# EAGLE design xduino360 (EAGLE 6.4)
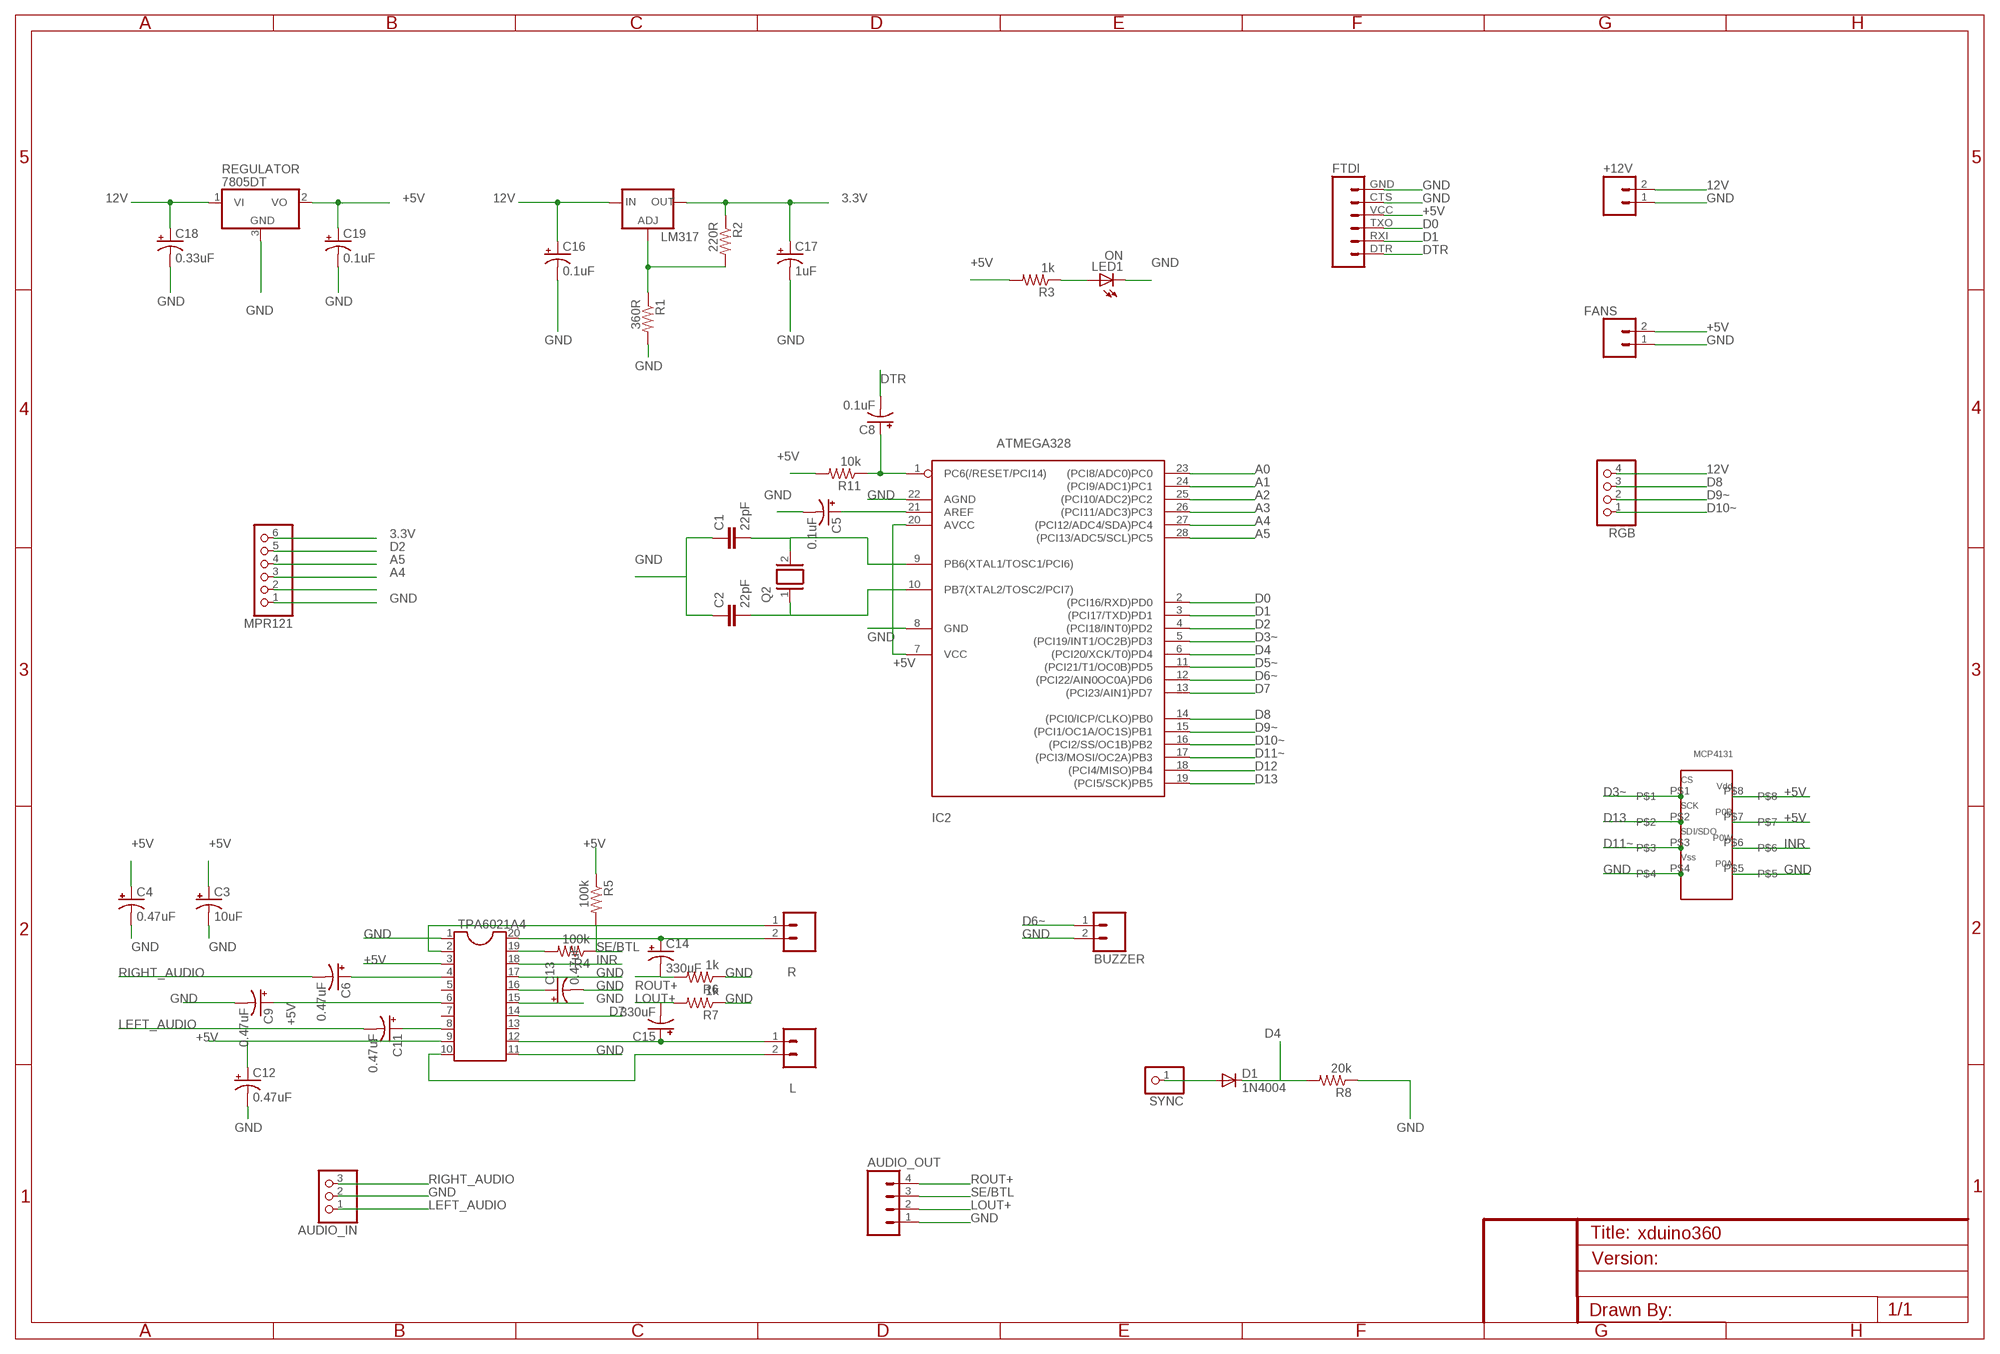
[diagram p0: schematic, sheet 1]

## Parts
+12V  M02PTH  [1X02]
AUDIO_IN  PINHD-1X3  [1X03]
AUDIO_OUT  M04PTH  [1X04]
BUZZER  M02PTH  [1X02]
C1  22pF  C5/2.5  [C5B2.5]
C2  22pF  C5/2.5  [C5B2.5]
C3  10uF  CPOL-USTT2D5  [TT2D5]
C4  0.47uF  CPOL-USTT2D5  [TT2D5]
C5  0.1uF  CPOL-USTT2D5  [TT2D5]
C6  0.47uF  CPOL-USTT2D5  [TT2D5]
C8  0.1uF  CPOL-USTT2D5  [TT2D5]
C9  0.47uF  CPOL-USTT2D5  [TT2D5]
C11  0.47uF  CPOL-USTT2D5  [TT2D5]
C12  0.47uF  CPOL-USTT2D5  [TT2D5]
C13  0.47uF  CPOL-USTT2D5  [TT2D5]
C14  330uF  CPOL-USTT2D5  [TT2D5]
C15  330uF  CPOL-USTT2D5  [TT2D5]
C16  0.1uF  CPOL-USTT2D5  [TT2D5]
C17  1uF  CPOL-USTT2D5  [TT2D5]
C18  0.33uF  CPOL-USTT2D5  [TT2D5]
C19  0.1uF  CPOL-USTT2D5  [TT2D5]
D1  1N4004  [DO41-10]
FANS  M02PTH  [1X02]
FTDI  FTDI_BASICPTH  [FTDI_BASIC]
IC2  ATMEGA328  ATMEGA168V-10P  [DIL28-3]
L  M02PTH  [1X02]
LED1  ON  LED3MM  [LED3MM]
LM317  V_REG_317DPACK  [V-REG_DPACK]
MCP4131  MCP4131  [MCP4131]
MPR121  PINHD-1X6  [1X06]
Q2  XTAL/S  [QS]
R  M02PTH  [1X02]
R1  360R  R-US_0204/2V  [0204V]
R2  220R  R-US_0204/2V  [0204V]
R3  1k  R-US_0204/2V  [0204V]
R4  100k  R-US_0204/2V  [0204V]
R5  100k  R-US_0204/2V  [0204V]
R6  1k  R-US_0204/2V  [0204V]
R7  1k  R-US_0204/2V  [0204V]
R8  20k  R-US_0204/2V  [0204V]
R11  10k  R-US_0204/2V  [0204V]
REGULATOR  7805DT  [TO252]
RGB  PINHD-1X4  [1X04]
SYNC  PINHD-1X1  [1X01]
TPA6021A4  DIL20  [DIL20]

## Nets
3.3V: C17.+ LM317.4(OUT) MPR121.6 R2.1
12V: +12V.2 C16.+ C18.+ LM317.3(IN) REGULATOR.1(VI) RGB.4
+5V: C3.+ C4.+ C9.+ C12.+ C19.+ FANS.2 FTDI.VCC IC2.7(VCC) IC2.20(AVCC) MCP4131.P$7 MCP4131.P$8 R3.2 R5.1 R11.2 REGULATOR.2(VO) TPA6021A4.3 TPA6021A4.6 TPA6021A4.9
A0: IC2.23((PCI8/ADC0)PC0)
A1: IC2.24((PCI9/ADC1)PC1)
A2: IC2.25((PCI10/ADC2)PC2)
A3: IC2.26((PCI11/ADC3)PC3)
A4: IC2.27((PCI12/ADC4/SDA)PC4) MPR121.3
A5: IC2.28((PCI13/ADC5/SCL)PC5) MPR121.4
D0: FTDI.TXO IC2.2((PCI16/RXD)PD0)
D1: FTDI.RXI IC2.3((PCI17/TXD)PD1)
D2: IC2.4((PCI18/INT0)PD2) MPR121.5
D3~: IC2.5((PCI19/INT1/OC2B)PD3) MCP4131.P$1
D4: D1.C IC2.6((PCI20/XCK/T0)PD4) R8.2
D5~: IC2.11((PCI21/T1/OC0B)PD5)
D6~: BUZZER.1 IC2.12((PCI22/AIN0OC0A)PD6)
D7: IC2.13((PCI23/AIN1)PD7) TPA6021A4.14
D8: IC2.14((PCI0/ICP/CLKO)PB0) RGB.3
D9~: IC2.15((PCI1/OC1A/OC1S)PB1) RGB.2
D10~: IC2.16((PCI2/SS/OC1B)PB2) RGB.1
D11~: IC2.17((PCI3/MOSI/OC2A)PB3) MCP4131.P$3
D12: IC2.18((PCI4/MISO)PB4)
D13: IC2.19((PCI5/SCK)PB5) MCP4131.P$2
DTR: C8.- FTDI.DTR
GND: +12V.1 AUDIO_IN.2 AUDIO_OUT.1 BUZZER.2 C1.1 C2.1 C3.- C4.- C5.- C9.- C12.- C13.- C16.- C17.- C18.- C19.- FANS.1 FTDI.CTS FTDI.GND IC2.8(GND) IC2.22(AGND) LED1.K(C) MCP4131.P$4 MCP4131.P$5 MPR121.1 R1.2 R6.1 R7.1 R8.1 REGULATOR.3(GND) TPA6021A4.1 TPA6021A4.11 TPA6021A4.15 TPA6021A4.17
INR: MCP4131.P$6 TPA6021A4.18
LEFT_AUDIO: AUDIO_IN.1 C11.-
LOUT+: AUDIO_OUT.2 C15.- R7.2
N$1: LM317.1(ADJ) R1.1 R2.2
N$2: C8.+ IC2.1(PC6(/RESET/PCI14)) R11.1
N$3: C2.2 IC2.10(PB7(XTAL2/TOSC2/PCI7)) Q2.1
N$6: C6.+ TPA6021A4.4
N$8: C1.2 IC2.9(PB6(XTAL1/TOSC1/PCI6)) Q2.2
N$9: C5.+ IC2.21(AREF)
N$12: C11.+ TPA6021A4.8
N$14: R.1 TPA6021A4.2
N$15: C13.+ TPA6021A4.16
N$16: R4.2 TPA6021A4.19
N$18: C14.+ R.2 TPA6021A4.20
N$20: C15.+ L.1 TPA6021A4.12
N$21: L.2 TPA6021A4.10
N$24: D1.A SYNC.1
N$25: MPR121.2
N$33: LED1.A R3.1
RIGHT_AUDIO: AUDIO_IN.3 C6.-
ROUT+: AUDIO_OUT.4 C14.- R6.2
SE/BTL: AUDIO_OUT.3 R4.1 R5.2
Unconnected: TPA6021A4.5 TPA6021A4.7 TPA6021A4.13

## Library data of the parts
+12V BUZZER FANS L R = SparkFun-Connectors:M02: Header 2 Standard 2-pin 0.1" header. Use with straight break away headers (SKU : PRT-00116), right angle break away headers (PRT-00553), swiss pins (PRT-00743), machine pins (PRT-00117), and female headers (PRT-00115). Molex polarized connector foot print use with SKU : PRT-08233 with associated crimp pins and housings.
AUDIO_IN = adafruit:PINHD-1X3: PIN HEADER
AUDIO_OUT = SparkFun-Connectors:M04: Header 4 Standard 4-pin 0.1" header. Use with straight break away headers (SKU : PRT-00116), right angle break away headers (PRT-00553), swiss pins (PRT-00743), machine pins (PRT-00117), and female headers (PRT-00115). Molex polarized connector foot print use with SKU : PRT-08231 with associated crimp pins and housings. 1MM SMD Version SKU: PRT-10208
C1 C2 = capacitor-wima:C: CAPACITOR naming: grid - package width
C3-C6 C8 C9 C11-C19 = adafruit:CPOL-US: POLARIZED CAPACITOR, American symbol
D1 = adafruit:1N4004: DIODE General purpose 1N400x type rectifier (With bigger pads) http://www.ladyada.net/library/pcb/eaglelibrary.html
FTDI = SparkFun-Connectors:FTDI_BASIC: FTDI Basic header with labels
IC2 = adafruit:ATMEGA168*P: MICROCONTROLLER 16 kBytes FLASH 1 kBytes SRAM 512 Bytes EEPROM USART 8-channel 10 bit ADC
LED1 = adafruit:LED: LED OSRAM: - CHIPLED LG R971, LG N971, LY N971, LG Q971, LY Q971, LO R971, LY R971 LH N974, LH R974 LS Q976, LO Q976, LY Q976 LO Q996 - Hyper CHIPLED LW Q18S LB Q993, LB Q99A, LB R99A - SideLED LS A670, LO A670, LY A670, LG A670, LP A670 LB A673, LV A673, LT A673, LW A673 LH A674 LY A675 LS A676, LA A676, LO A676, LY A676, LW A676 LS A679, LY A679, LG A679 - Hyper Micro SIDELED® LS Y876, LA Y876, LO Y876, LY Y876 LT Y87S - SmartLED LW L88C, LW L88S LB L89C, LB L89S, LG L890 LS L89K, LO L89K, LY L89K LS L896, LA L896, LO L896, LY L896 - TOPLED LS T670, LO T670, LY T670, LG T670, LP T670 LSG T670, LSP T670, LSY T670, LOP T670, LYG T670 LG T671, LOG T671, LSG T671 LB T673, LV T673, LT T673, LW T673 LH T674 LS T676, LA T676, LO T676, LY T676, LB T676, LH T676, LSB T676, LW T676 LB T67C, LV T67C, LT T67C, LS T67K, LO T67K, LY T67K, LW E67C LS E67B, LA E67B, LO E67B, LY E67B, LB E67C, LV E67C, LT E67C LW T67C LS T679, LY T679, LG T679 LS T770, LO T770, LY T770, LG T770, LP T770 LB T773, LV T773, LT T773, LW T773 LH T774 LS E675, LA E675, LY E675, LS T675 LS T776, LA T776, LO T776, LY T776, LB T776 LHGB T686 LT T68C, LB T68C - Hyper Mini TOPLED® LB M676 - Mini TOPLED Santana® LG M470 LS M47K, LO M47K, LY M47K Source: http://www.osram.convergy.de/
LM317 = SparkFun-PowerIC:V_REG_317: Voltage Regulator Standard LM317 adjustable voltage regulator. AOI (Adjust Output Input). Google 'LM317 Calculator' for easy to use app to get the two resistor values needed. 240/720 for 5V output. 240/390 for 3.3V output. Spark Fun Electronics SKU : COM-00527
MCP4131 = mcp4131:MCP4131
MPR121 = adafruit:PINHD-1X6: PIN HEADER
Q2 = special:XTAL/S: CRYSTAL
R1-R8 R11 = adafruit:R-US_: RESISTOR, American symbol
REGULATOR = linear:78*: Positive VOLTAGE REGULATOR Source: http://cache.national.com/ds/LM/LM78L05.pdf http://www.fairchildsemi.com/ds/LM/LM7805.pdf
RGB = pinhead:PINHD-1X4: PIN HEADER
SYNC = adafruit:PINHD-1X1: Pin header 1x1 for 0.1" spacing With round pins
TPA6021A4 = ic-package:DIL20: Dual In Line / Socket

## Net classes
0 default: width 0.152 mm, drill 0.635 mm, clearance 0.254 mm

## Board
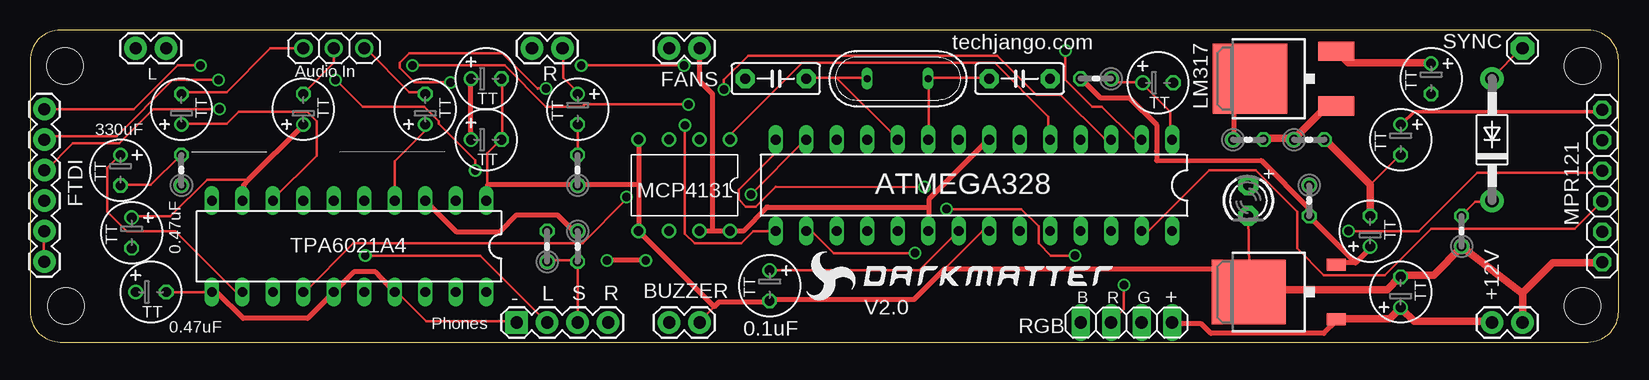
[diagram p1: board, top side]
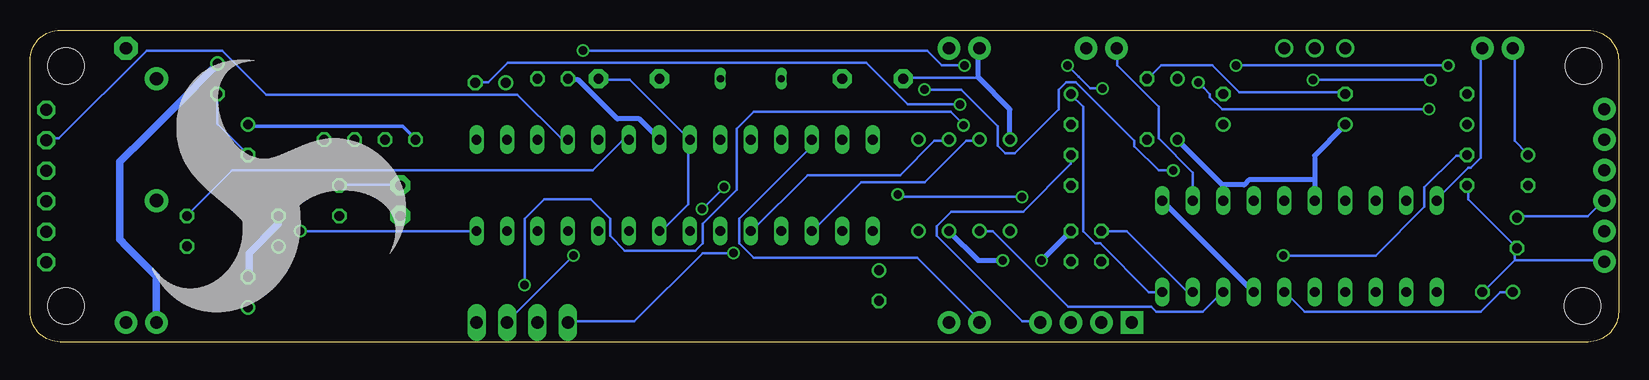
[diagram p2: board, bottom side, seen from below]

Size 132.38 x 26 mm. Coordinates in mm from the lower left corner, seen from the top.
Outline: 2.54,0 129.84,0 arc90 132.38,2.54 132.38,23.46 arc90 129.84,26 2.54,26 arc90 0,23.46 0,2.54 arc90 2.54,0
Copper layers (1*2*15*16): Top 0.035mm / dielectric 0.2mm / Route2 0.0175mm / dielectric 1.1mm / Route15 0.0175mm / dielectric 0.2mm / Bottom 0.035mm
Design rules "SeeedStudio_DRU_no_angle_20130527 *": minimum track width 8mil, minimum drill 12mil, track to track 8mil, track to pad 8mil, pad to pad 8mil, via to via 8mil, smd to smd 0mil, copper to edge 10mil, drill to drill 10mil, minimum pad ring 6mil, minimum via ring 6mil, stop-mask expansion 2mil, vias tented up to drill 25mil, thermal gap 10mil

### Footprints (pad centres in the part's own frame; a part is rotated, then mirrored left to right if it is on the bottom)
1X02 = drill 1.016 pad 1.88: 1 0,0; 2 2.54,0
1X03 = drill 1.016: 1 -2.54,0; 2 0,0; 3 2.54,0
1X04 = drill 1.016 pad 1.88 square: 1 0,0 | drill 1.016 pad 1.88: 2 2.54,0; 3 5.08,0; 4 7.62,0
C5B2.5 = drill 0.813 pad 1.6 octagon: 1 -2.54,0; 2 2.54,0
TT2D5 = drill 0.813: + -1.27,0 | drill 0.813 octagon: - 1.27,0
DO41-10 = drill 1.118 pad 1.93: A 5.08,0; C -5.08,0
FTDI_BASIC = drill 1.016 pad 1.88: CTS 10.16,0; DTR 0,0; GND 12.7,0; RXI 2.54,0; TXO 5.08,0; VCC 7.62,0
DIL28-3 = drill 0.813 long: 1 -16.51,-3.81; 2 -13.97,-3.81; 3 -11.43,-3.81; 4 -8.89,-3.81; 5 -6.35,-3.81; 6 -3.81,-3.81; 7 -1.27,-3.81; 8 1.27,-3.81; 9 3.81,-3.81; 10 6.35,-3.81; 11 8.89,-3.81; 12 11.43,-3.81; 13 13.97,-3.81; 14 16.51,-3.81; 15 16.51,3.81; 16 13.97,3.81; 17 11.43,3.81; 18 8.89,3.81; 19 6.35,3.81; 20 3.81,3.81; 21 1.27,3.81; 22 -1.27,3.81; 23 -3.81,3.81; 24 -6.35,3.81; 25 -8.89,3.81; 26 -11.43,3.81; 27 -13.97,3.81; 28 -16.51,3.81
LED3MM = drill 0.813 pad 1.676 octagon: A -1.27,0; K 1.27,0
V-REG_DPACK = smd 1.6 x 3: 1 -2.28,-4.8; 3 2.28,-4.8 | smd 5.8 x 6.2: 4 0,2.38
MCP4131 = drill 0.8: P$1 -3.81,-3.81; P$2 -1.27,-3.81; P$3 1.27,-3.81; P$4 3.81,-3.81; P$5 3.81,3.81; P$6 1.27,3.81; P$7 -1.27,3.81; P$8 -3.81,3.81
1X06 = drill 1.016 octagon: 1 -6.35,0; 2 -3.81,0; 3 -1.27,0; 4 1.27,0; 5 3.81,0; 6 6.35,0
QS = drill 0.61 long: 1 -2.54,0; 2 2.54,0
0204V = drill 0.813 octagon: 1 -1.27,0; 2 1.27,0
TO252 = smd 1 x 1.6: 1 -2.28,-4.8; 2 2.28,-4.8 | smd 5.4 x 6.2: 3 0,2.5
1X04' = drill 1.016 long: 1 -3.81,0; 2 -1.27,0; 3 1.27,0; 4 3.81,0
1X01 = drill 1.016 pad 1.93 octagon: 1 0,0
DIL20 = drill 0.813 long: 1 -11.43,-3.81; 2 -8.89,-3.81; 3 -6.35,-3.81; 4 -3.81,-3.81; 5 -1.27,-3.81; 6 1.27,-3.81; 7 3.81,-3.81; 8 6.35,-3.81; 9 8.89,-3.81; 10 11.43,-3.81; 11 11.43,3.81; 12 8.89,3.81; 13 6.35,3.81; 14 3.81,3.81; 15 1.27,3.81; 16 -1.27,3.81; 17 -3.81,3.81; 18 -6.35,3.81; 19 -8.89,3.81; 20 -11.43,3.81
STAND-OFF-TIGHT = hole 3.048: 0,0

### Placement (x,y rotation side)
+12V  124.38,1.62 180 top
AUDIO_IN  25.32,24.48 0 top
AUDIO_OUT  40.56,1.62 0 top
BUZZER  53.26,1.62 0 top
C1  82.47,21.94 180 top
C2  62.15,21.94 0 top
C3  38.02,16.86 0 top
C4  38.02,21.94 0 top
C5  61.63,4.7 270 top
C6  32.94,19.4 90 top
C8  94,21.6 0 top
C9  22.78,19.4 90 top
C11  12.62,19.4 90 top
C12  8.47,9.09 270 top
C13  10.08,4.16 0 top
C14  45.64,19.4 270 top
C15  7.54,14.32 270 top
C16  116.76,21.94 270 top
C17  114.22,16.86 270 top
C18  114.22,4.16 90 top
C19  111.68,9.24 90 top
D1  121.84,16.86 90 top
FANS  53.26,24.48 0 top
FTDI  1.19,19.4 270 top
IC2  78.66,13.05 180 top
L  8.81,24.48 0 top
LED1  101.52,11.78 270 top
LM317  104.06,21.94 90 top
MCP4131  54.53,13.05 180 top
MPR121  131.02,13 90 top
Q2  72.31,21.94 0 top
R  41.83,24.48 0 top
R1  106.6,16.86 0 top
R2  101.52,16.86 0 top
R3  106.6,11.78 270 top
R4  43.1,7.97 90 top
R5  45.64,7.97 270 top
R6  45.64,14.32 90 top
R7  12.62,14.32 90 top
R8  119.3,9.24 90 top
R11  88.82,21.94 180 top
REGULATOR  104.06,4.16 90 top
RGB  [1X04']  91.36,1.62 0 top
SYNC  124.38,24.48 90 top
TPA6021A4  26.59,7.97 180 top
U$1  [STAND-OFF-TIGHT]  2.92,23 0 top
U$2  [STAND-OFF-TIGHT]  3,3 0 top
U$3  [STAND-OFF-TIGHT]  129.38,23 0 top
U$4  [STAND-OFF-TIGHT]  129.38,3 0 top

### Tracks (layer width: path | path; a pad name or v marks a point on that pad's centre or on a via)
3.3V
  Top 0.203: 100.3,20.62 101.52,21.84 LM317.4 | 100.3,16.96 R2.1 | 130.98,19.2 MPR121.6 | 114.32,18.18 C17.+
  Top 0.305: 130.98,19.2 115.34,19.2 114.32,18.18
  Top 0.406: 100.3,20.62 100.3,16.96
  Bottom 0.203: 100.3,16.96 R2.1
  Bottom 0.305: 100.3,16.96 101.32,17.98 114.12,17.98 C17.+
12V
  Top 0.203: 116.76,23.26 C16.+ | 109.04,24.07 LM317.3 | 109.04,1.92 REGULATOR.1 108.83,1.72 | 114.12,2.74 C18.+ 114.32,2.74 | 121.84,1.72 +12V.2 | 95.22,1.52 RGB.4
  Top 0.406: 95.22,1.52 97.61,1.52 98.4,0.72 107.82,0.73 108.83,1.72
  Top 0.61: 116.76,23.26 109.85,23.26 109.04,24.07 | 109.04,1.92 113.31,1.92 114.12,2.74 | 121.84,1.72 115.34,1.72 114.32,2.74
  Bottom 0.203: 116.76,23.15 C16.+ | 121.84,1.72 +12V.2
  Bottom 0.61: 116.76,23.15 120.42,19.49 121.46,18.44 122.75,17.16 124.89,15.01 124.91,12.6 124.89,8.56 124.34,7.97 121.84,5.47 +12V.2
+5V  (via drill 0.7)
  Top 0.203: 36.75,21.84 C4.+ | 36.75,16.96 C3.+ | 17.8,11.88 TPA6021A4.9 | 22.68,17.98 C9.+ | 18.21,13.51 14.75,13.51 11.71,10.46 8.66,10.46 C12.+ | 109.04,6.6 REGULATOR.2 | 111.68,7.82 C19.+ | 106.6,10.46 R3.2 | 74.9,9.24 IC2.20 | 61.49,11.25 61.37,11.18 | 45.31,9.23 R5.1
  Top 0.406: 36.75,16.96 36.75,21.84 | 17.8,11.88 17.8,13.1 18.21,13.51 22.68,17.98 | 56.88,9.24 MCP4131.P$8 59.45,9.24 61.37,11.18 61.45,11.26 | 56.88,9.24 MCP4131.P$7 | FANS.2 55.79,21.73 56.88,20.65 56.88,9.24 | 110.46,6.6 109.04,6.6 | 111.68,7.82 110.46,6.6 | 110.46,6.6 106.6,10.46 | 74.9,11.25 74.9,11.88 79.78,16.76 IC2.7 | 74.9,11.25 74.9,9.24 | R3.2 106.6,11.12 102.6,15.13 93.89,15.12 93.89,15.91 93.89,18.1 91.61,20.36 89.18,20.36 87.7,21.84 R11.2 | 61.49,11.25 74.9,11.25 | 45.31,9.23 43.95,10.59 40.56,10.59 39.18,9.2 35.52,9.2 TPA6021A4.3 | v51.31,6.79 v48.08,6.8
  Bottom 0.203: 33.04,11.88 TPA6021A4.3 | 36.7,16.76 C3.+ | C12.+ 8.45,10.46 2.56,10.46 1.34,11.68 FTDI.VCC | 22.88,17.98 C9.+ | 87.5,21.84 R11.2
  Bottom 0.406: 33.04,13.1 33.04,11.88 | 36.7,16.76 33.04,13.1 | 25.32,13.51 25.32,15.54 22.88,17.98 | 25.32,13.51 TPA6021A4.6 | 33.04,13.1 31.21,13.1 30.81,13.51 25.32,13.51 | 87.5,21.84 86.69,21.84 83.44,18.59 81.61,18.59 79.98,16.96 IC2.7 | v48.08,6.8 R5.1 | v51.31,6.79 53.36,6.8 MCP4131.P$7
A4
  Top 0.203: IC2.27 93.19,9.24 98.27,14.32 102.13,14.32 105.58,10.87 105.58,7.82 107.82,5.58 112.9,5.58 116.76,9.44 128.75,9.44 130.98,11.68 MPR121.3
A5  (via drill 0.7)
  Top 0.203: v109.86,9.24 115.74,9.24 120.62,14.12 130.98,14.12 MPR121.4
  Bottom 0.203: v109.86,9.24 IC2.28
D0  (via drill 0.7)
  Top 0.203: v86.28,24.28 86.28,21.84 88.52,19.6 89.33,19.6 91.97,16.96 92.58,16.96 IC2.2 | v45.94,23.06 v54.52,23.06 | v43,21.14 42.33,21.14 42.3,21.11 40.36,23.06 39.34,24.07 31.62,24.07 30.81,23.26 30.81,22.85 32.03,21.64 v35.03,21.64 | v15.79,19.41 10.28,19.4 7.44,16.55 3.58,16.55 1.34,14.32 FTDI.TXO
  Bottom 0.203: v86.28,24.28 57.63,24.28 56.41,23.06 v54.52,23.06 | v43,21.14 44.02,21.14 44.97,22.09 v45.94,23.06 | v35.03,21.64 34.57,21.17 34.06,20.66 34.06,20.42 33.04,19.4 v15.79,19.41
D1  (via drill 0.7)
  Top 0.203: v57.83,21.03 57.83,21.84 59.86,23.87 80.59,23.87 83.84,20.62 85.87,20.62 89.53,16.96 89.94,16.96 IC2.3 | v37.11,14.3 37.11,15.13 34.06,18.18 34.06,18.38 32.84,19.6 27.73,19.6 v25.47,21.84 | v15.69,21.84 11.91,21.84 7.23,17.16 1.55,17.16 1.34,16.96 FTDI.RXI
  Bottom 0.203: v57.83,21.03 54.78,21.03 51.74,17.98 51.74,16.35 51.13,15.74 50.31,15.74 46.66,19.4 46.66,21.03 46.05,21.64 45.23,21.64 40.36,16.76 40.36,16.32 38.33,14.3 v37.11,14.3 | v15.69,21.84 v25.47,21.84
D2
  Bottom 0.203: IC2.4 87.7,16.96 88.11,16.96 91.77,20.62 112.7,20.62 116.35,24.28 122.65,24.28 129.97,16.96 130.98,16.96 MPR121.5
D3~
  Top 0.203: MCP4131.P$1 58.44,16.96 58.44,17.37 64.33,23.26 80.39,23.26 84.86,18.79 84.86,16.96 IC2.5
D4
  Top 0.203: D1.C 121.84,11.68 120.42,11.68 119.4,10.66 R8.2
  Bottom 0.203: IC2.6 82.62,16.76 83.03,16.76 85.47,14.32 115.54,14.32 119.2,10.66 R8.2
D6~
  Bottom 0.203: IC2.12 67.38,16.76 67.38,16.15 73.28,10.26 73.28,8.22 72.06,7.01 58.44,7.01 53.16,1.72 BUZZER.1
D7  (via drill 0.7)
  Top 0.203: v49.7,12.09 49.7,11.88 46.05,8.22 26.95,8.22 22.88,4.16 TPA6021A4.14 | v60.07,12.29 64.54,16.76 IC2.13
  Bottom 0.203: v49.7,12.09 59.86,12.09 v60.07,12.29
D8  (via drill 0.7)
  Top 0.203: v74.54,12.91 62.14,12.93 60.47,11.27 59.66,11.27 59.05,11.88 59.05,12.69 62.1,15.74 62.1,16.76 IC2.14 | v76.37,11.07 82.62,11.07 84.05,9.65 84.05,8.22 85.06,7.21 v87.09,7.21
  Bottom 0.203: v76.37,11.07 v74.54,12.91 | v87.09,7.21 92.58,1.72 RGB.3
D9~  (via drill 0.7)
  Top 0.203: IC2.15 60.27,9.24 59.25,8.22 55.39,8.22 54.58,9.04 v54.57,18.07 | v91.16,4.73 91.16,2.74 90.14,1.72 RGB.2
  Bottom 0.203: v54.57,18.07 54.89,18.43 55.64,19.18 72.06,19.2 73.48,17.77 73.48,12.69 76.32,9.85 76.32,8.22 76.93,7.61 82.83,7.61 84.05,8.83 84.05,10.26 85.67,11.88 89.53,11.88 91.16,10.26 v91.16,4.73
D10~  (via drill 0.7)
  Top 0.203: IC2.16 65.15,9.24 66.98,7.41 v73.76,7.41
  Bottom 0.203: v73.76,7.41 76.32,7.41 82.01,1.72 87.5,1.72 RGB.1
D11~
  Bottom 0.203: MCP4131.P$3 53.36,16.76 54.38,16.76 57.83,13.3 63.12,13.3 67.18,9.24 IC2.17
D13
  Bottom 0.203: MCP4131.P$2 55.8,16.76 57.02,16.76 59.86,13.91 67.59,13.91 72.26,9.24 IC2.19
DTR  (via drill 0.7)
  Top 0.203: v54.89,19.81 46.25,19.81 46.05,19.6 43,19.6 39.54,23.06 v31.87,23.06 | v14.2,23.06 12.32,23.06 8.66,19.4 FTDI.DTR
  Bottom 0.203: v54.89,19.81 59.25,19.81 62.71,23.26 92.58,23.26 94.2,21.64 95.22,21.64 C8.- | v14.2,23.06 v31.87,23.06
GND
  Top 0.203: FTDI.GND 1.14,6.8 1.14,9.24 FTDI.CTS | C13.- TPA6021A4.11 15.57,4.16 | 22.88,20.62 C9.- 22.88,20.82 25.32,23.26 AUDIO_IN.2 | TPA6021A4.15 | 38.12,13.1 38.12,15.74 39.14,16.76 C3.- 39.34,16.96 39.34,21.84 C4.- | 38.12,11.88 TPA6021A4.1 | 111.68,13.1 114.12,15.54 C17.- | 108.02,16.76 R1.2 | 101.59,6.1 LED1.K | 119.31,7.93 119.2,7.82 R8.1 | 114.32,5.58 C18.- 114.12,5.38 | 130.98,6.6 MPR121.1 | 57.02,2.94 55.8,1.72 BUZZER.2 | IC2.22 79.37,9.24 76.22,6.09 | 61.69,3.55 C5.- | 45.64,13.1 R6.1 | AUDIO_OUT.1 40.56,1.72 33.04,1.72 30.6,4.16 TPA6021A4.17 | 101.52,4.16 101.52,4.36 REGULATOR.3 101.52,4.16
  Top 0.406: TPA6021A4.15 26.98,5.84 28.8,5.84 TPA6021A4.17 | 38.12,11.88 38.12,13.1 45.64,13.1 50.72,13.1 | 15.57,4.16 17.75,1.97 23.13,1.97 TPA6021A4.15 | 101.52,4.36 101.59,6.1 76.22,6.09 73.68,3.55 61.69,3.55 | C5.- 61.49,3.35 57.43,3.35 57.02,2.94 MCP4131.P$5 50.72,13.1 | MCP4131.P$4 50.72,13.1
  Top 0.61: C19.- 111.68,13.1 108.02,16.76 | 114.32,5.58 116.96,5.58 119.31,7.93 124.38,4.02 +12V.1 124.39,4.11 126.89,6.6 130.98,6.6 | 101.52,4.36 113.1,4.36 114.12,5.38
  Bottom 0.203: 8.66,6.8 8.66,7.82 C12.- 8.66,8.02 12.52,11.88 12.52,12.9 R7.1 | 8.66,6.8 11.3,4.16 C13.- | 8.66,6.8 1.34,6.8 FTDI.GND | C4.- 39.14,22.04 38.12,23.06 33.85,23.06 31.62,20.82 22.88,20.82 C9.- | C16.- 116.76,18.18 114.32,15.74 C17.- | 114.12,5.58 C18.- | IC2.22 79.78,9.24 77.54,11.48 77.54,16.76 IC2.8 77.54,16.96 82.42,21.84 84.86,21.84 C1.1 | 53.36,24.48 FANS.1 | C2.1 59.46,22.04 53.37,22.04 53.38,22.05 | 50.72,16.96 MCP4131.P$4
  Bottom 0.406: TPA6021A4.1 TPA6021A4.17 | 53.37,22.04 53.36,24.48 | 50.72,16.96 50.72,19.39 53.38,22.05
  Bottom 0.61: C19.- 111.68,9.85 114.12,7.41 114.12,5.58
INR
  Bottom 0.203: MCP4131.P$6 52.14,9.24 45.84,2.94 38.93,2.94 38.53,2.53 34.67,2.53 33.04,4.16 TPA6021A4.18
LEFT_AUDIO
  Top 0.203: AUDIO_IN.1 20.04,24.48 16.38,20.82 12.72,20.82 C11.-
LOUT+  (via drill 0.7)
  Top 0.203: C15.- 7.64,13.1 10.08,13.1 12.52,15.54 R7.2 | AUDIO_OUT.2 37.51,7.21 v27.94,7.21
  Bottom 0.203: v27.94,7.21 20.24,7.21 16.18,11.27 16.18,12.9 13.53,15.54 12.72,15.54 R7.2
N$1
  Top 0.203: 102.94,16.96 R2.2 | 105.18,16.96 R1.1 105.38,16.96 | 108.02,19.6 108.83,19.6 LM317.1
  Top 0.61: 105.18,16.96 102.94,16.96 | 105.38,16.96 108.02,19.6
N$2
  Top 0.203: R11.1 90.14,21.84 90.34,21.64 92.58,21.64 C8.+ 92.78,21.43 95.02,19.2 95.02,16.96 IC2.1
N$3
  Top 0.203: 67.18,22.04 64.74,22.04 C2.2 | 67.18,22.04 69.62,22.04 Q2.1 | 67.18,22.04 72.26,16.96 IC2.10
N$6
  Top 0.203: TPA6021A4.4 30.4,11.88 30.4,12.81 30.39,14.61 30.39,14.88 30.4,15.08 32.95,17.62 32.94,17.94 C6.+
N$8
  Top 0.203: C1.2 79.78,22.04 74.9,22.04 Q2.2 74.9,21.84 74.9,16.96 IC2.9
N$9
  Top 0.203: C5.+ 61.69,5.99 74.09,5.99 77.34,9.24 IC2.21
N$12
  Top 0.203: C11.+ 12.72,18.18 16.38,18.18 17.39,19.2 23.09,19.2 23.9,18.38 23.9,15.54 20.24,11.88 TPA6021A4.8
N$14
  Bottom 0.203: TPA6021A4.2 35.48,14.12 38.33,16.96 38.33,19.6 41.78,23.06 41.78,24.48 R.1
N$15
  Bottom 0.203: C13.+ 9.88,4.16 11.5,2.53 26.13,2.53 27.76,4.16 TPA6021A4.16
N$16
  Bottom 0.203: TPA6021A4.19 35.89,4.16 40.97,9.24 R4.2
N$18
  Top 0.203: R.2 44.42,24.48 44.42,22.04 45.64,20.82 C14.+
  Bottom 0.203: TPA6021A4.20 39.14,4.16 43.2,8.22 43.61,8.22 44.62,9.24 44.62,19.6 45.64,20.62 C14.+
N$20
  Top 0.203: TPA6021A4.12 17.19,4.16 12.11,9.24 8.05,9.24 6.42,10.87 6.42,14.52 7.44,15.54 C15.+
  Bottom 0.203: L.1 8.66,24.48 8.66,16.76 7.64,15.74 C15.+
N$21
  Bottom 0.203: TPA6021A4.10 15.16,11.88 12.52,14.52 12.32,14.52 11.5,15.34 11.5,24.48 L.2
N$24
  Top 0.203: D1.A 121.84,22.04 124.28,24.48 SYNC.1
N$33
  Bottom 0.203: R3.1 106.6,13.1 101.52,13.1 LED1.A
RIGHT_AUDIO
  Top 0.203: C6.- 32.84,20.82 31.62,20.82 27.96,24.48 AUDIO_IN.3
ROUT+
  Top 0.203: C14.- R6.2
  Bottom 0.203: R6.2 45.64,14.85 49.63,10.86 55.6,10.87 56.82,9.65 56.82,8.83 49.7,1.72 48.28,1.72 AUDIO_OUT.4
SE/BTL
  Top 0.203: R4.1 43.2,6.8 45.64,6.8 R5.2 AUDIO_OUT.3

### Text on the board
tPlace: techjango.com | Audio In | - | L | S | R | B | R | G | + | V2.0 | Phones